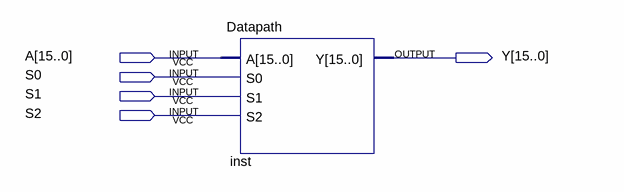
[diagram p0: schematic sheet]
// Quartus schematic Bai2.bdf as structural Verilog: 1 symbols, 5 pins
module Bai2 (
  input  [15:0] A,
  input  S0,
  input  S1,
  input  S2,
  output [15:0] Y
);

  Datapath inst (.A(A), .S0(S0), .S1(S1), .S2(S2), .Y(Y));
endmodule
